# Altium schematic sheet inKard-Link.SchDoc
size A4
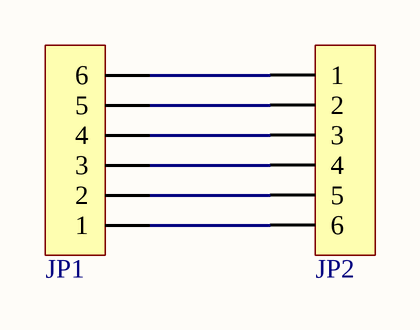
[diagram p0: inKard-Link.SchDoc]

## Parts
JP1  HDR-1X6  [HDR2.54-M-LI-6P]  (value not drawn)
JP2  HDR-1X6  [HDR1.27-LI-6P]  (value not drawn)

## Nets
NetJP1_1: JP1.1 JP2.6
NetJP1_2: JP1.2 JP2.5
NetJP1_3: JP1.3 JP2.4
NetJP1_4: JP1.4 JP2.3
NetJP1_5: JP1.5 JP2.2
NetJP1_6: JP1.6 JP2.1

## Library data of the parts
JP1 JP2 = Header 6: 6P接插件; 版权归属: 源创客; BOM名称: 6P接插件; 学习资源: www.ooocke.com